# EasyEDA schematic JOYSTICK_INTERFACE.json
TITLE: Micro-Switch to analog bridge; REV: 1.0; Date: 2023-05-02; Sheet: 1/1; Company: Amir BS
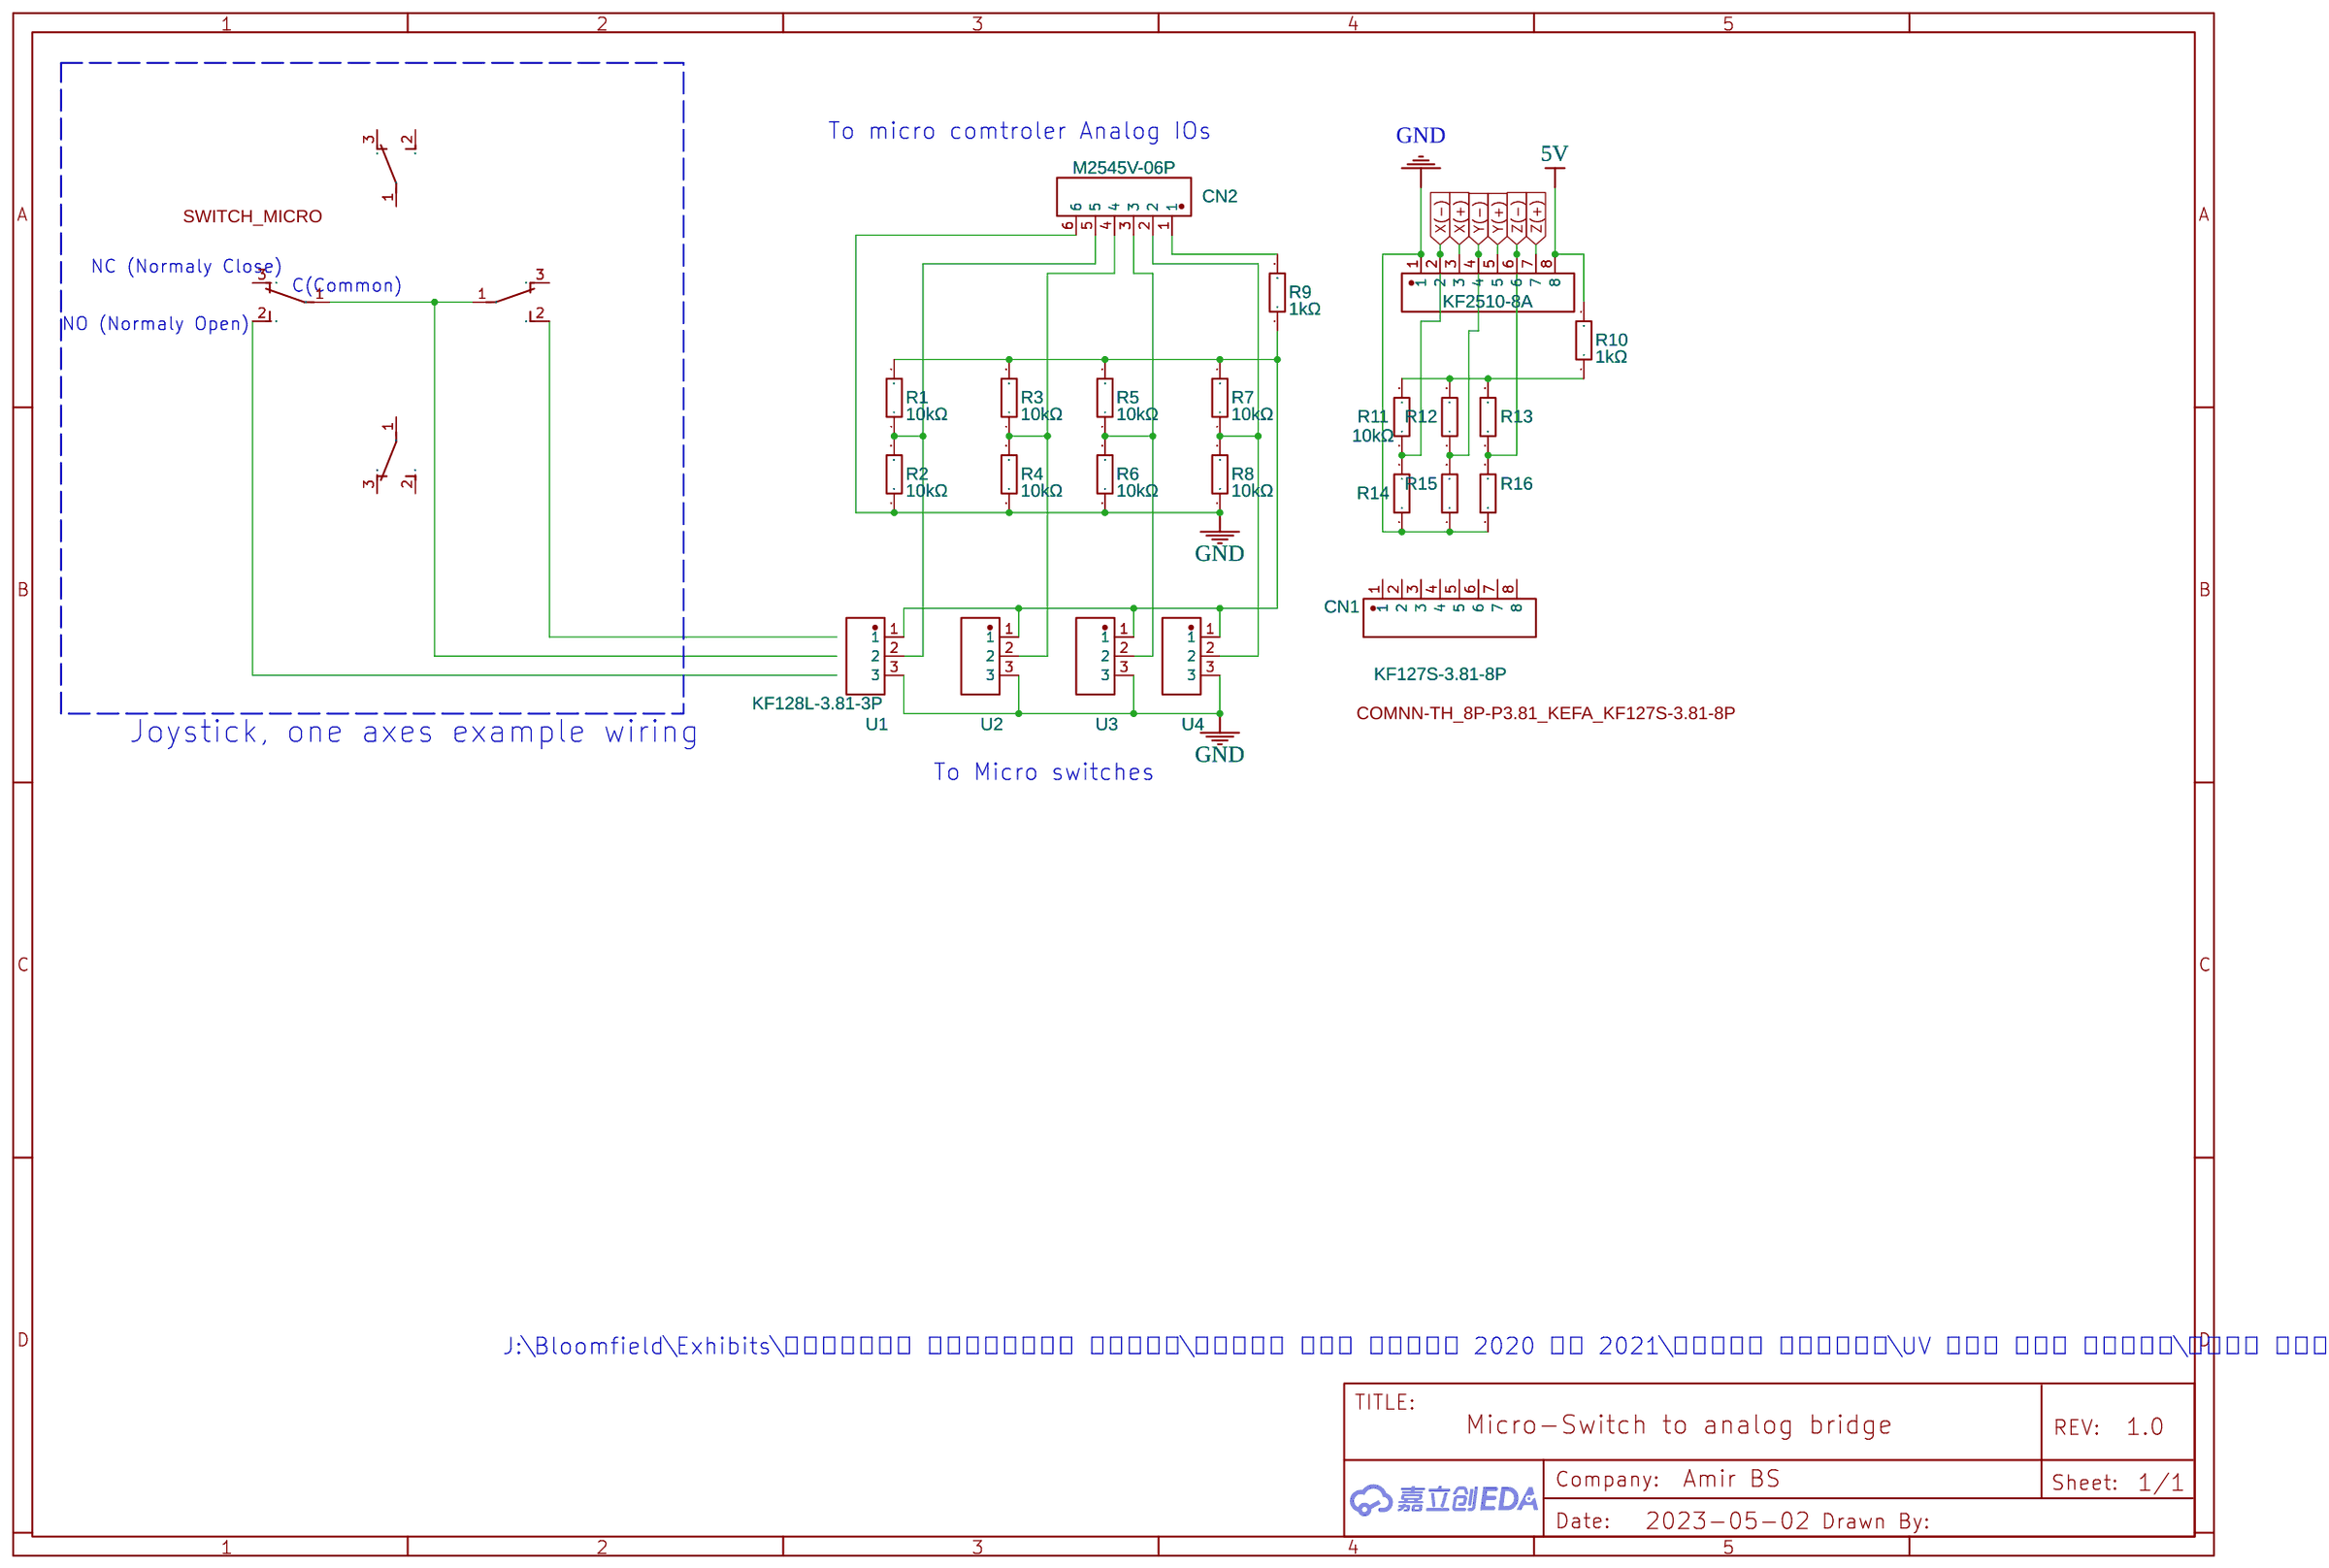
[diagram p0: schematic sheet]

## Parts
CN1  KF127S-3.81-8P  [COMNN-TH_8P-P3.81_KEFA_KF127S-3.81-8P]
CN2  M2545V-06P  [CONN-TH_6P-P2.54_M2545V-06P]
CN3  KF2510-8A  [CONN-TH_8P-P2.54_KF2510-8A]
R1  10kΩ  [R0603]
R2  10kΩ  [R0603]
R3  10kΩ  [R0603]
R4  10kΩ  [R0603]
R5  10kΩ  [R0603]
R6  10kΩ  [R0603]
R7  10kΩ  [R0603]
R8  10kΩ  [R0603]
R9  1kΩ  [R0603]
R10  1kΩ  [R0603]
R11  10kΩ  [R0603]
R12  10kΩ  [R0603]
R13  10kΩ  [R0603]
R14  10kΩ  [R0603]
R15  10kΩ  [R0603]
R16  10kΩ  [R0603]
S1  MICRO SWITCH_3Pin  [SWITCH_MICRO]
S2  MICRO SWITCH_3Pin  [SWITCH_MICRO]
S3  MICRO SWITCH_3Pin  [SWITCH_MICRO]
S4  MICRO SWITCH_3Pin  [SWITCH_MICRO]
U1  KF128L-3.81-3P  [CONN-TH_3P-P3.81_KF128L-3.81-3P]
U2  KF128L-3.81-3P  [CONN-TH_3P-P3.81_KF128L-3.81-3P]
U3  KF128L-3.81-3P  [CONN-TH_3P-P3.81_KF128L-3.81-3P]
U4  KF128L-3.81-3P  [CONN-TH_3P-P3.81_KF128L-3.81-3P]

## Library data of the parts
CN1 = KF127S-3.81-8P: Contributor: lcsc; Supplier: LCSC; Supplier Part: C2974916; Manufacturer: KEFA(科发); JLCPCB Part Class: Extended Part; Package Display: Yes
CN2 = M2545V-06P: Supplier: LCSC; Supplier Part: C492454; Manufacturer: XFCN(台湾兴飞); Contributor: LCSC; JLCPCB Part Class: Extended Part; Package Display: No
CN3 = KF2510-8A: Contributor: LCSC; Supplier: LCSC; Supplier Part: C503487; Manufacturer: BOOMELE(博穆精密); JLCPCB Part Class: Extended Part; Package Display: No
R1-R8 R11-R16 = 0603WAF1002T5E: Supplier: LCSC; Manufacturer: UNI-ROYAL(厚声); Supplier Part: C25804; Resistance (Ohms): 10K; JLCPCB Part Class: Basic Part; Package Display: No
R9 R10 = 0603WAF1001T5E: Supplier: LCSC; Manufacturer: UNI-ROYAL(厚声); Supplier Part: C21190; Resistance (Ohms): 1K; JLCPCB Part Class: Basic Part; Package Display: No
S1 = MICRO SWITCH_3Pin: Contributor: MAV.640; Package Display: Yes
S2-S4 = MICRO SWITCH_3Pin: Contributor: MAV.640; Package Display: No
U1-U4 = KF128L-3.81-3P: Supplier: LCSC; Supplier Part: C474933; Manufacturer: KEFA(科发); Contributor: LCSC; JLCPCB Part Class: Extended Part; Package Display: No

## Nets
5V: CN3.8 R10.2
GND: CN2.6 CN3.1 R2.1 R4.1 R6.1 R8.1 R14.1 R15.1 R16.1 U1.3 U2.3 U3.3 U4.3
X(+): CN3.3
X(-): CN3.2 R11.1 R14.2
Y(+): CN3.5
Y(-): CN3.4 R12.1 R15.2
Z(+): CN3.7
Z(-): CN3.6 R13.1 R16.2
Net-(CN2-1): CN2.1 R9.2
Net-(CN2-2): CN2.2 R7.1 R8.2 U4.2
Net-(CN2-3): CN2.3 R5.1 R6.2 U3.2
Net-(CN2-4): CN2.4 R3.1 R4.2 U2.2
Net-(CN2-5): CN2.5 R1.1 R2.2 U1.2
Net-(R1-2): R1.2 R3.2 R5.2 R7.2 R9.1 U1.1 U2.1 U3.1 U4.1
Net-(R10-1): R10.1 R11.2 R12.2 R13.2
Net-(S1-1): S1.1 S2.1

Not connected (* = marked no-connect by the designer): CN1 1 2 3 4 5 6 7 8; S1 2 3; S2 2 3; S3 1 2 3; S4 1 2 3

## Notes on the sheet
- To micro comtroler Analog IOs
- NC (Normaly Close)
- C(Common)
- NO (Normaly Open)
- Joystick, one axes example wiring
- To Micro switches
- J:\Bloomfield\Exhibits\רעיונות לתערוכות חדשות\הדפסה תלת ממדית 2020 או 2021\פיתוח מוצגים\UV תלת ממד בנוזל\יותם עמרני פיתוח מוצג\התחברות לידית היגוי כניסות אנלוגיות
